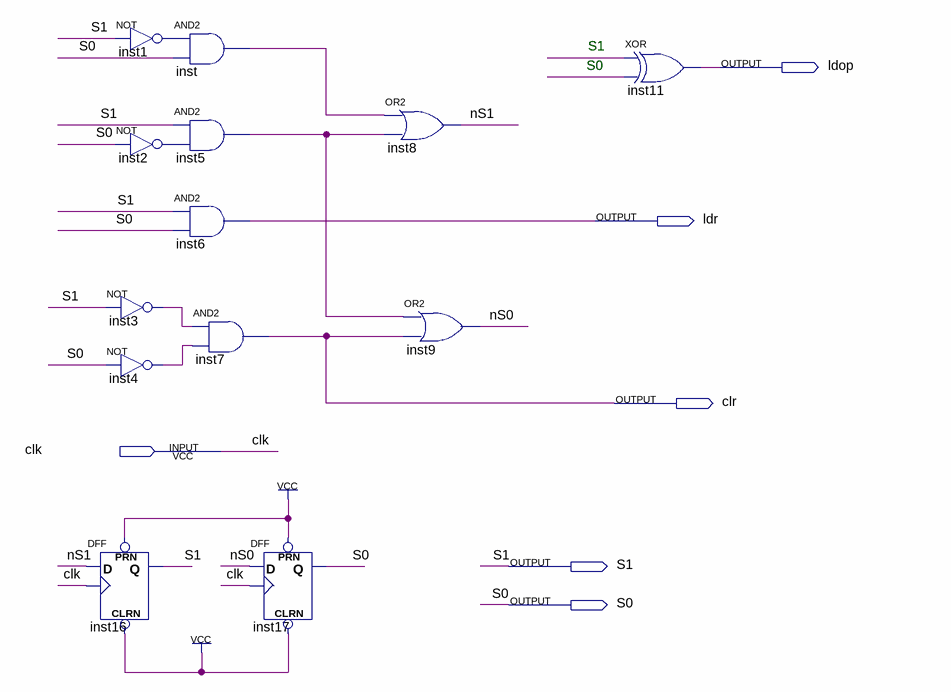
[diagram p0: schematic sheet]
// Quartus schematic fsm.bdf as structural Verilog: 13 symbols, 6 pins
module fsm (
  input  clk,
  output ldop,
  output ldr,
  output clr,
  output S1,
  output S0
);

  wire inst1_out, inst2_out, inst3_out, inst4_out, inst5_out, inst_out, nS0, nS1;

  not inst1 (inst1_out, S1);
  not inst2 (inst2_out, S0);
  not inst3 (inst3_out, S1);
  not inst4 (inst4_out, S0);
  DFF inst16 (.CLRN(1'b1), .CLK(clk), .D(nS1), .PRN(1'b1), .Q(S1));
  and inst (inst_out, inst1_out, S0);
  and inst5 (inst5_out, S1, inst2_out);
  and inst6 (ldr, S1, S0);
  and inst7 (clr, inst3_out, inst4_out);
  DFF inst17 (.CLRN(1'b1), .CLK(clk), .D(nS0), .PRN(1'b1), .Q(S0));
  or inst8 (nS1, inst_out, inst5_out);
  or inst9 (nS0, inst5_out, clr);
  xor inst11 (ldop, S1, S0);

  // Notes on the sheet:
  //   S1
  //   S0
endmodule
